# Altium schematic sheet 原理图.schdoc
size 297 x 204 mm
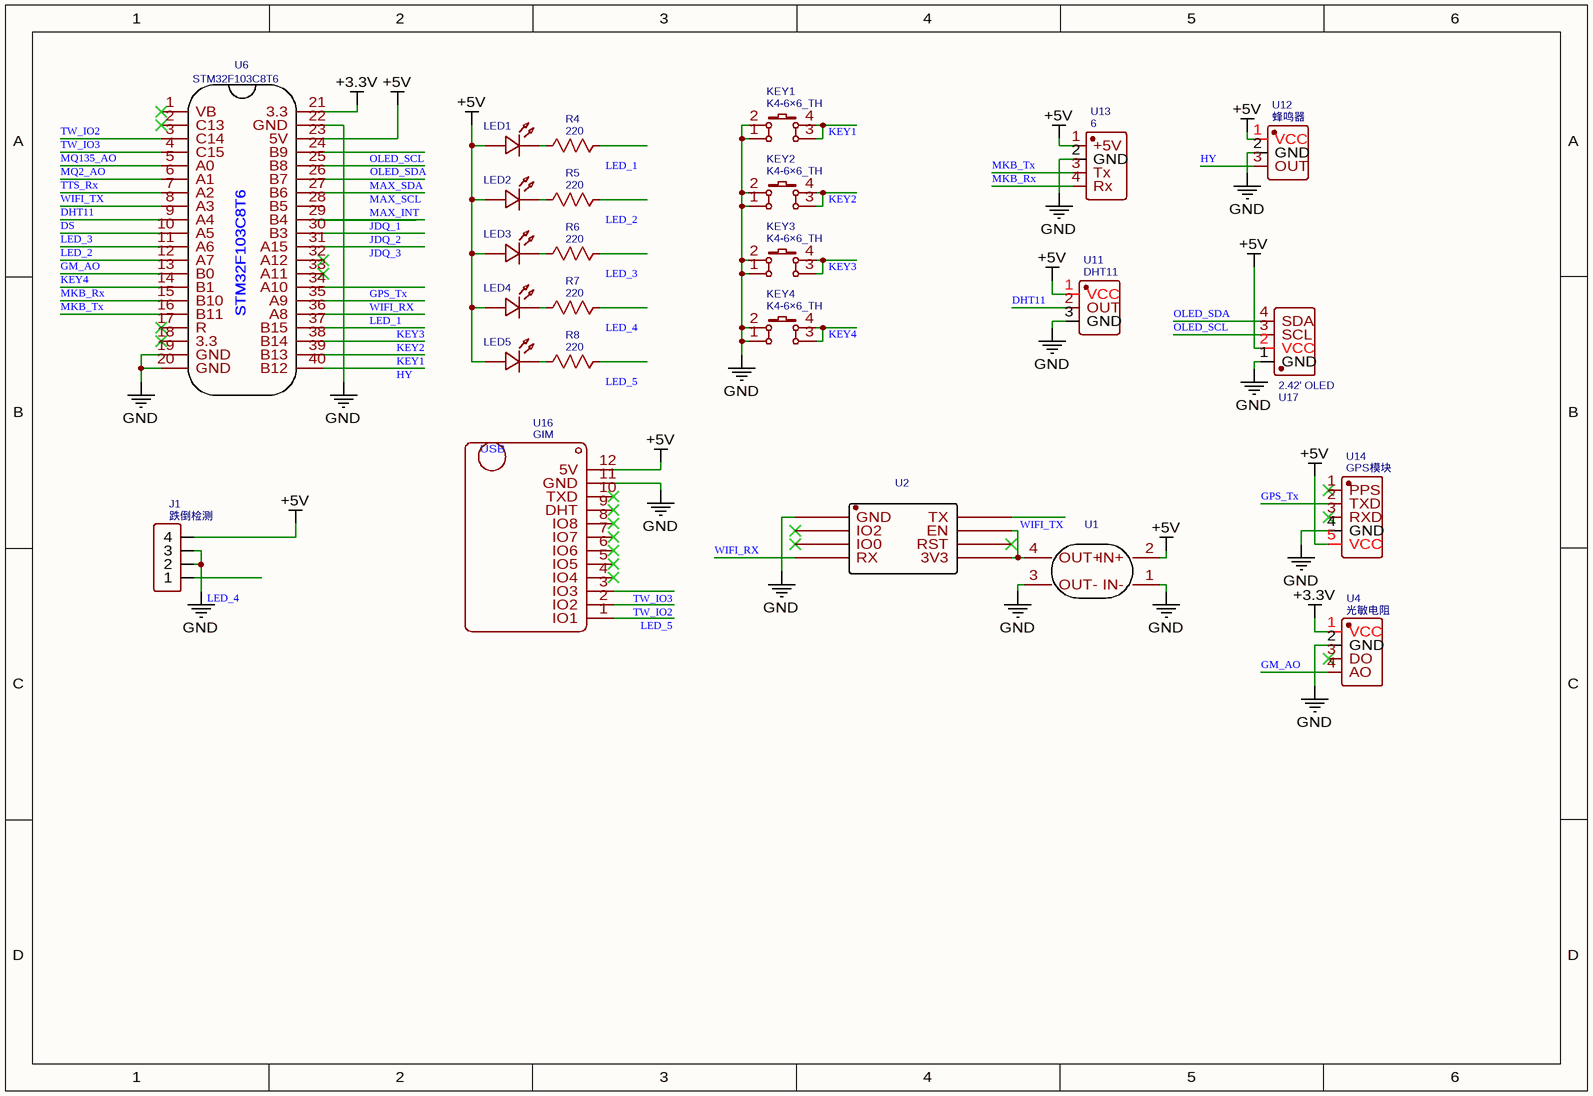
[diagram p0: 原理图.schdoc]

## Parts
J1  跌倒检测  [HDR-M-2.54_1X4]
KEY1  K4-6×6_TH  [KEY-TH_4P-L6.0-W6.0-P4.50-LS6.5]
KEY2  K4-6×6_TH  [KEY-TH_4P-L6.0-W6.0-P4.50-LS6.5]
KEY3  K4-6×6_TH  [KEY-TH_4P-L6.0-W6.0-P4.50-LS6.5]
KEY4  K4-6×6_TH  [KEY-TH_4P-L6.0-W6.0-P4.50-LS6.5]
LED1  LED-TH-3mm_R  [LED-TH_BD3.0_RED]  (value not drawn)
LED2  LED-TH-3mm_G  [LED-TH_BD3.0_GREEN]  (value not drawn)
LED3  LED-TH-3mm_G  [LED-TH_BD3.0_GREEN]  (value not drawn)
LED4  LED-TH-3mm_G  [LED-TH_BD3.0_GREEN]  (value not drawn)
LED5  LED-TH-3mm_G  [LED-TH_BD3.0_GREEN]  (value not drawn)
R4  220  [R_AXIAL-0.3]
R5  220  [R_AXIAL-0.3]
R6  220  [R_AXIAL-0.3]
R7  220  [R_AXIAL-0.3]
R8  220  [R_AXIAL-0.3]
U1  NO  [3.3V稳压模块]  (value not drawn)
U2  NO  [ESP8266-01S]  (value not drawn)
U4  光敏电阻  [HDR-M-2.54_1X4]
U6  STM32F103C8T6  [STM32F103C8T6]
U11  DHT11  [HDR-M-2.54_1X3]
U12  蜂鸣器  [HDR-M-2.54_1X3]
U13  6  [HDR-M-2.54_1X4]
U14  GPS模块  [HDR-M-2.54_1X5]
U16  GIM  [LU-ASR01]
U17  2.42' OLED  [HDR-M-2.54_1X4]

## Nets
+3.3V: U4.1(VCC) U6.21(3.3)
+5V: J1.4 LED1.1 LED2.1 LED3.1 LED4.1 LED5.1 U1.2(IN+) U6.23(5V) U11.1(VCC) U12.1(VCC) U13.1(+5V) U14.5(VCC) U16.12(5V) U17.2(VCC)
GND: J1.2 J1.3 KEY1.1 KEY1.2 KEY2.1 KEY2.2 KEY3.1 KEY3.2 KEY4.1 KEY4.2 U1.1(IN-) U1.3(OUT-) U2.1(GND) U4.2(GND) U6.19(GND) U6.20(GND) U6.22(GND) U11.3(GND) U12.2(GND) U13.2(GND) U14.4(GND) U16.11(GND) U17.1(GND)
DHT11: U6.9(A4) U11.2(OUT)
DS: U6.10(A5)
GM_AO: U4.4(AO) U6.13(B0)
GPS_Tx: U14.2(TXD)
HY: U12.3(OUT)
KEY4: U6.14(B1)
LED_2: U6.12(A7)
LED_3: U6.11(A6)
LED_5: U16.1(IO1)
MKB_Rx: U6.15(B10) U13.4(Rx)
MKB_Tx: U6.16(B11) U13.3(Tx)
MQ2_AO: U6.6(A1)
MQ135_AO: U6.5(A0)
OLED_SCL: U17.3(SCL)
OLED_SDA: U6.26(B7) U17.4(SDA)
TTS_Rx: U6.7(A2)
TW_IO2: U6.3(C14) U16.2(IO2)
TW_IO3: U6.4(C15) U16.3(IO3)
WIFI_RX: U2.4(RX)
WIFI_TX: U2.8(TX) U6.8(A3)
NetKEY1_3: KEY1.3 KEY1.4
NetKEY2_3: KEY2.3 KEY2.4
NetKEY3_3: KEY3.3 KEY3.4
NetKEY4_3: KEY4.3 KEY4.4
NetLED1_2: LED1.2 R4.1
NetLED2_2: LED2.2 R5.1
NetLED3_2: LED3.2 R6.1
NetLED4_2: LED4.2 R7.1
NetLED5_2: LED5.2 R8.1
NetU1_4: U1.4(OUT+) U2.5(3V3) U2.7(EN)

Not connected (* = marked no-connect by the designer): J1 1; R4 2; R5 2; R6 2; R7 2; R8 2; U2 2(IO2)* 3(IO0)* 6(RST)*; U4 3(DO)*; U6 1(VB)* 2(C13)* 17(R)* 18(3.3)* 24(B9) 25(B8) 27(B6) 28(B5) 29(B4) 30(B3) 31(A15) 32(A12)* 33(A11)* 34(A10) 35(A9) 36(A8) 37(B15) 38(B14) 39(B13) 40(B12); U14 1(PPS)* 3(RXD)*; U16 4(IO4)* 5(IO5)* 6(IO6)* 7(IO7)* 8(IO8)* 9(DHT)* 10(TXD)*

## Notes on the sheet
- (near U6) STM32F103C8T6
- Labels drawn without touching a wire or pin: GPS_Tx, HY, JDQ_1, JDQ_2, JDQ_3, KEY1, KEY2, KEY3, KEY4, LED_1, LED_2, LED_3, LED_4, LED_5, MAX_SCL, MAX_SDA, OLED_SCL, WIFI_RX
- (in symbol 天问语音模块 COPY) USB

## Library data of the parts
J1 = HDR-M-2.54_1x4: Contributor: LCEDA_Lib; Supplier Part: C124378; Supplier: LCSC; spicePre: J; spiceSymbolName: HDR-M-2.54_1x4
KEY1-KEY4 = K4-6×6_TH: Manufacturer: 韩国韩荣; Manufacturer Part: K2-1102DP-E4SW-04; Contributor: LCEDA_Lib; Supplier: LCSC; Supplier Part: C136684; spicePre: K; spiceSymbolName: K4-6×6_TH
LED1 = LED-TH-3mm_R: Manufacturer: EVERLIGHT(台湾亿光); Manufacturer Part: 204-10SDRD/S530-A3-L; Contributor: LCEDA_Lib; Supplier Part: C84774; Supplier: LCSC; spicePre: L; spiceSymbolName: LED-TH-3mm_R
LED2-LED5 = LED-TH-3mm_G: Manufacturer: EVERLIGHT(台湾亿光); Manufacturer Part: 204-10SYGD/S530-E3; Contributor: LCEDA_Lib; Supplier Part: C85161; spicePre: L; spiceSymbolName: LED-TH-3mm_G
R4-R8 = 220: nameAlias: Value(Ω); Contributor: LCEDA_Lib; spicePre: R; spiceSymbolName: R_AXIAL-0.3_US
U1 = NO: Contributor: littlebai; spicePre: U; spiceSymbolName: 3.3V稳压
U2 = NO: Contributor: Eenglish; spicePre: U; spiceSymbolName: ESP8266-01S
U6 = STM32F103C8T6: Contributor: ab_cd; spicePre: U; spiceSymbolName: STM32F103C8T6
U12 = 火焰传感器: spicePre: X; spiceSymbolName: 继电器
U13 = MKB0805: spicePre: X; spiceSymbolName: MKB0805
U16 = 天问语音模块 COPY: Contributor: tokite; spicePre: U; spiceSymbolName: 天问语音模块 COPY
U4 = 光敏电阻: spicePre: X; spiceSymbolName: 光敏电阻
U11 = DHT11: spicePre: X; spiceSymbolName: DS18B20
U14 = GPS模块: spicePre: X; spiceSymbolName: GPS模块
U17 = 2.42' OLED: spicePre: X; spiceSymbolName: 2.42' OLED